# EAGLE design RSS 0.3 (EAGLE 6.5.0)
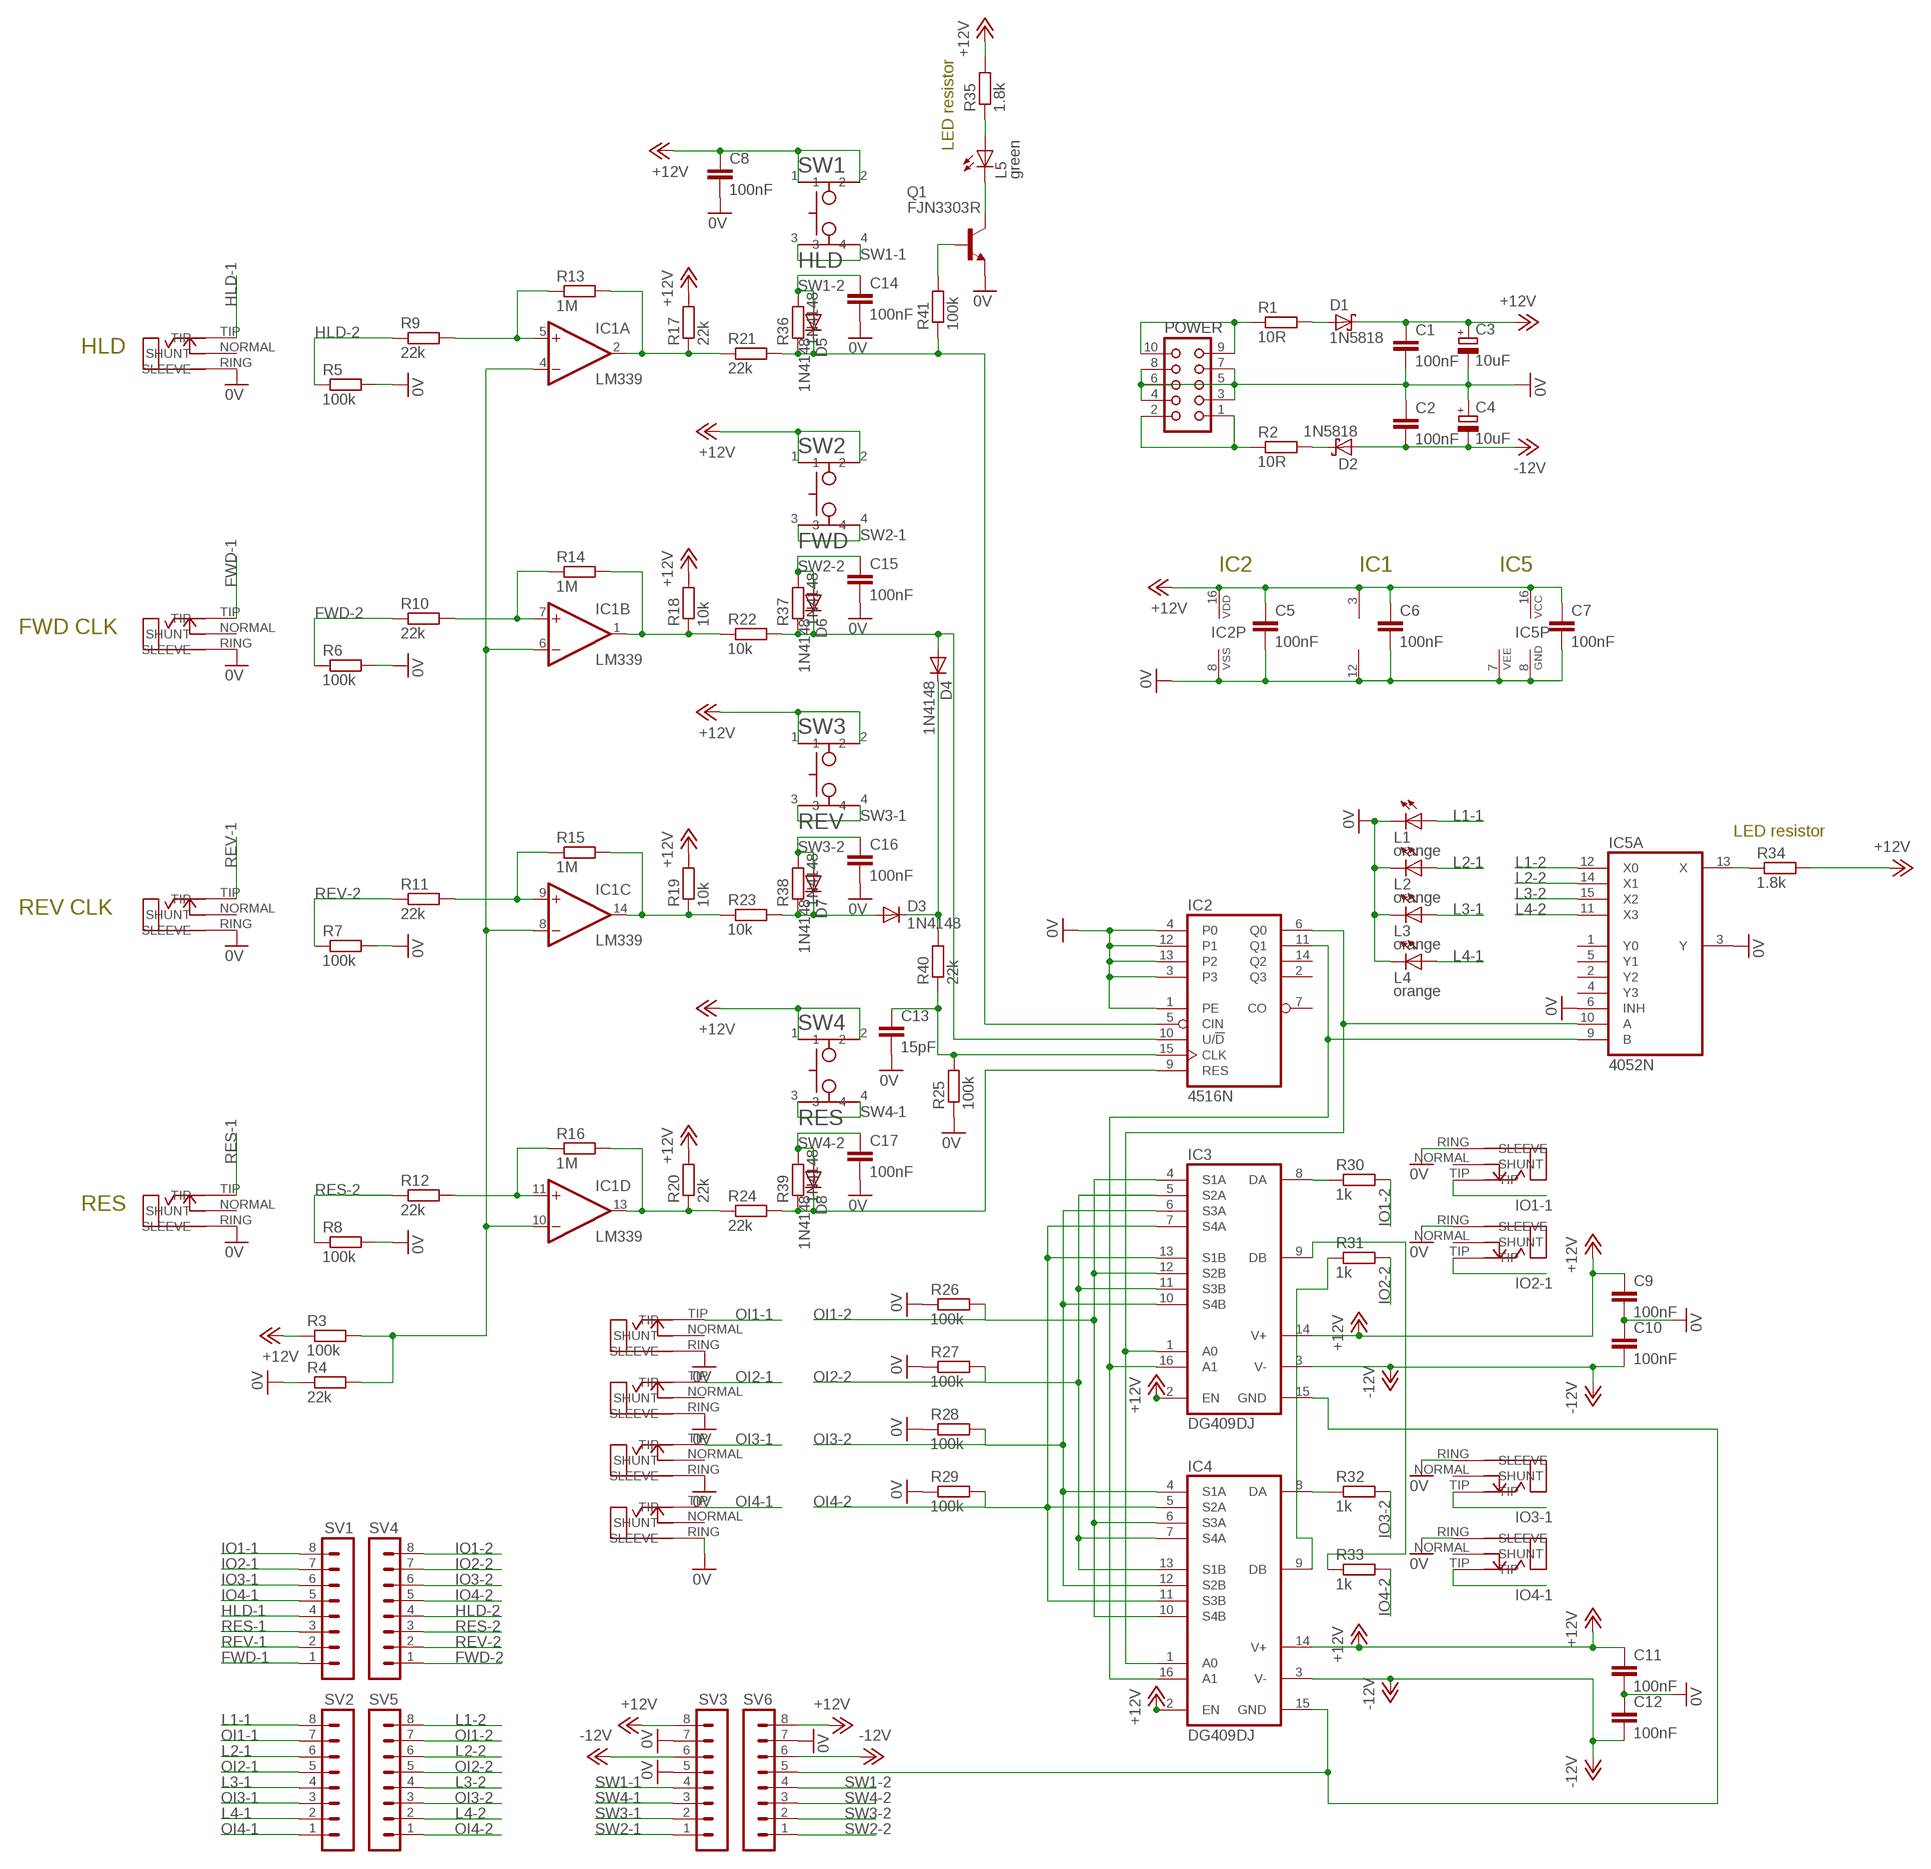
[diagram p0: schematic, sheet 1]

## Parts
C1  100nF  C-EU025-024X044  [C025-024X044]
C2  100nF  C-EU025-024X044  [C025-024X044]
C3  10uF  CPOL-EUE2-5  [E2-5]
C4  10uF  CPOL-EUE2-5  [E2-5]
C5  100nF  C-EU025-024X044  [C025-024X044]
C6  100nF  C-EU025-024X044  [C025-024X044]
C7  100nF  C-EU025-024X044  [C025-024X044]
C8  100nF  C-EU025-024X044  [C025-024X044]
C9  100nF  C-EU025-024X044  [C025-024X044]
C10  100nF  C-EU025-024X044  [C025-024X044]
C11  100nF  C-EU025-024X044  [C025-024X044]
C12  100nF  C-EU025-024X044  [C025-024X044]
C13  15pF  C-EU025-024X044  [C025-024X044]
C14  100nF  C-EU025-024X044  [C025-024X044]
C15  100nF  C-EU025-024X044  [C025-024X044]
C16  100nF  C-EU025-024X044  [C025-024X044]
C17  100nF  C-EU025-024X044  [C025-024X044]
D1  1N5818  SB130DO-204AL  [DO41-7]
D2  1N5818  SB130DO-204AL  [DO41-7]
D3  1N4148  1N4148DO35-7  [DO35-7]
D4  1N4148  1N4148DO35-7  [DO35-7]
D5  1N4148  1N4148DO35-7  [DO35-7]
D6  1N4148  1N4148DO35-7  [DO35-7]
D7  1N4148  1N4148DO35-7  [DO35-7]
D8  1N4148  1N4148DO35-7  [DO35-7]
FWD  ERTHENVAR_3.5MM_JACK  [THONKICON]
HLD  ERTHENVAR_3.5MM_JACK  [THONKICON]
I/O1  ERTHENVAR_3.5MM_JACK  [THONKICON]
I/O2  ERTHENVAR_3.5MM_JACK  [THONKICON]
I/O3  ERTHENVAR_3.5MM_JACK  [THONKICON]
I/O4  ERTHENVAR_3.5MM_JACK  [THONKICON]
IC1  LM339  LM2901N  [DIL14]
IC2  4516N  [DIL16]
IC3  DG409DJ  [DIL16]
IC4  DG409DJ  [DIL16]
IC5  4052N  [DIL16]
L1  orange  LED3MM  [LED3MM]
L2  orange  LED3MM  [LED3MM]
L3  orange  LED3MM  [LED3MM]
L4  orange  LED3MM  [LED3MM]
L5  green  LED3MM  [LED3MM]
O/I1  ERTHENVAR_3.5MM_JACK  [THONKICON]
O/I2  ERTHENVAR_3.5MM_JACK  [THONKICON]
O/I3  ERTHENVAR_3.5MM_JACK  [THONKICON]
O/I4  ERTHENVAR_3.5MM_JACK  [THONKICON]
POWER  CON10L  [CON10L]
Q1  FJN3303R  [TO92-LINE]
R1  10R  R-EU_0207/10  [0207/9]
R2  10R  R-EU_0207/10  [0207/9]
R3  100k  R-EU_0207/10  [0207/9]
R4  22k  R-EU_0207/10  [0207/9]
R5  100k  R-EU_0207/10  [0207/9]
R6  100k  R-EU_0207/10  [0207/9]
R7  100k  R-EU_0207/10  [0207/9]
R8  100k  R-EU_0207/10  [0207/9]
R9  22k  R-EU_0207/10  [0207/9]
R10  22k  R-EU_0207/10  [0207/9]
R11  22k  R-EU_0207/10  [0207/9]
R12  22k  R-EU_0207/10  [0207/9]
R13  1M  R-EU_0207/10  [0207/9]
R14  1M  R-EU_0207/10  [0207/9]
R15  1M  R-EU_0207/10  [0207/9]
R16  1M  R-EU_0207/10  [0207/9]
R17  22k  R-EU_0207/10  [0207/9]
R18  10k  R-EU_0207/10  [0207/9]
R19  10k  R-EU_0207/10  [0207/9]
R20  22k  R-EU_0207/10  [0207/9]
R21  22k  R-EU_0207/10  [0207/9]
R22  10k  R-EU_0207/10  [0207/9]
R23  10k  R-EU_0207/10  [0207/9]
R24  22k  R-EU_0207/10  [0207/9]
R25  100k  R-EU_0207/10  [0207/9]
R26  100k  R-EU_0207/10  [0207/9]
R27  100k  R-EU_0207/10  [0207/9]
R28  100k  R-EU_0207/10  [0207/9]
R29  100k  R-EU_0207/10  [0207/9]
R30  1k  R-EU_0207/10  [0207/9]
R31  1k  R-EU_0207/10  [0207/9]
R32  1k  R-EU_0207/10  [0207/9]
R33  1k  R-EU_0207/10  [0207/9]
R34  1.8k  R-EU_0207/10  [0207/9]
R35  1.8k  R-EU_0207/10  [0207/9]
R36  1N4148  R-EU_0207/10  [0207/9]
R37  1N4148  R-EU_0207/10  [0207/9]
R38  1N4148  R-EU_0207/10  [0207/9]
R39  1N4148  R-EU_0207/10  [0207/9]
R40  22k  R-EU_0207/10  [0207/9]
R41  100k  R-EU_0207/10  [0207/9]
RES  ERTHENVAR_3.5MM_JACK  [THONKICON]
REV  ERTHENVAR_3.5MM_JACK  [THONKICON]
SV1  MA08-1  [MA08-1]
SV2  MA08-1  [MA08-1]
SV3  MA08-1  [MA08-1]
SV4  MA08-1  [MA08-1]
SV5  MA08-1  [MA08-1]
SV6  MA08-1  [MA08-1]
SW1  HLD  TACTILE_ALPS  [TACTILE_ALPS]
SW2  FWD  TACTILE_ALPS  [TACTILE_ALPS]
SW3  REV  TACTILE_ALPS  [TACTILE_ALPS]
SW4  RES  TACTILE_ALPS  [TACTILE_ALPS]

## Nets
0V: C1.2 C2.1 C3.- C4.+ C5.2 C6.2 C7.2 C8.2 C9.2 C10.1 C11.2 C12.1 C13.2 C14.2 C15.2 C16.2 C17.2 FWD.RING(SLEEVE) HLD.RING(SLEEVE) I/O1.RING(SLEEVE) I/O2.RING(SLEEVE) I/O3.RING(SLEEVE) I/O4.RING(SLEEVE) IC1.12(P:V-) IC2.1(PE) IC2.3 IC2.4(P0) IC2.8(VSS) IC2.12(P1) IC2.13(P2) IC5.3(A:Y) IC5.6(A:INH) IC5.7(P:VEE) IC5.8(P:GND) L1.K(C) L2.K(C) L3.K(C) L4.K(C) O/I1.RING(SLEEVE) O/I2.RING(SLEEVE) O/I3.RING(SLEEVE) O/I4.RING(SLEEVE) POWER.3 POWER.4 POWER.5 POWER.6 POWER.7 POWER.8 Q1.3(E) R4.1 R5.2 R6.2 R7.2 R8.2 R25.1 R26.1 R27.1 R28.1 R29.1 RES.RING(SLEEVE) REV.RING(SLEEVE) SV3.5 SV3.7 SV6.7
+12V: C1.1 C3.+ C5.1 C6.1 C7.1 C8.1 C9.1 C11.1 D1.C IC1.3(P:V+) IC2.16(VDD) IC3.2(EN) IC3.14(V+) IC4.2(EN) IC4.14(V+) IC5.16(P:VCC) R3.1 R17.2 R18.2 R19.2 R20.2 R34.2 R35.2 SV3.8 SV6.8 SW1.1 SW1.2 SW2.1 SW2.2 SW3.1 SW3.2 SW4.1 SW4.2
-12V: C2.2 C4.- C10.2 C12.2 D2.A IC3.3(V-) IC4.3(V-) SV3.6 SV6.6
FWD-1: FWD.TIP SV1.1
FWD-2: R6.1 R10.1 SV4.1
HLD-1: HLD.TIP SV1.4
HLD-2: R5.1 R9.1 SV4.4
IO1-1: I/O1.TIP SV1.8
IO1-2: R30.2 SV4.8
IO2-1: I/O2.TIP SV1.7
IO2-2: R31.2 SV4.7
IO3-1: I/O3.TIP SV1.6
IO3-2: R32.2 SV4.6
IO4-1: I/O4.TIP SV1.5
IO4-2: R33.2 SV4.5
L1-1: L1.A SV2.8
L1-2: IC5.12(A:X0) SV5.8
L2-1: L2.A SV2.6
L2-2: IC5.14(A:X1) SV5.6
L3-1: L3.A SV2.4
L3-2: IC5.15(A:X2) SV5.4
L4-1: L4.A SV2.2
L4-2: IC5.11(A:X3) SV5.2
N$1: IC2.11(Q1) IC3.16(A1) IC4.16(A1) IC5.9(A:B)
N$2: IC2.6(Q0) IC3.1(A0) IC4.1(A0) IC5.10(A:A)
N$3: IC3.15(GND) IC4.15(GND) SV6.5
N$4: C13.1 IC2.15(CLK) R25.2 R40.1
N$5: IC3.9(DB) R33.1
N$6: IC4.9(DB) R31.1
N$7: Q1.1(B) R41.2
N$9: IC4.8(DA) R32.1
N$13: IC3.8(DA) R30.1
N$16: IC1.14(C:OUT) R15.2 R19.1 R23.1
N$19: IC5.13(A:X) R34.1
N$20: D5.C IC2.5(CIN) R21.2 R36.1 R41.1
N$21: IC1.7(B:+IN) R10.2 R14.1
N$22: POWER.1 POWER.2 R2.1
N$23: POWER.9 POWER.10 R1.1
N$24: D1.A R1.2
N$25: D2.C R2.2
N$26: IC1.5(A:+IN) R9.2 R13.1
N$27: IC1.9(C:+IN) R11.2 R15.1
N$28: IC1.2(A:OUT) R13.2 R17.1 R21.1
N$29: IC1.4(A:-IN) IC1.6(B:-IN) IC1.8(C:-IN) IC1.10(D:-IN) R3.2 R4.2
N$31: IC1.11(D:+IN) R12.2 R16.1
N$34: D4.A D6.C IC2.10(U/!D) R22.2 R37.1
N$35: D8.C IC2.9(RES) R24.2 R39.1
N$39: D3.C D4.C R40.2
N$40: IC1.13(D:OUT) R16.2 R20.1 R24.1
N$41: L5.A R35.1
N$42: IC1.1(B:OUT) R14.2 R18.1 R22.1
N$43: L5.K(C) Q1.2(C)
N$46: D3.A D7.C R23.2 R38.1
OI1-1: O/I1.TIP SV2.7
OI1-2: IC3.4(S1A) IC3.12(S2B) IC4.6(S3A) IC4.10(S4B) R26.2 SV5.7
OI2-1: O/I2.TIP SV2.5
OI2-2: IC3.5(S2A) IC3.11(S3B) IC4.7(S4A) IC4.13(S1B) R27.2 SV5.5
OI3-1: O/I3.TIP SV2.3
OI3-2: IC3.6(S3A) IC3.10(S4B) IC4.4(S1A) IC4.12(S2B) R28.2 SV5.3
OI4-1: O/I4.TIP SV2.1
OI4-2: IC3.7(S4A) IC3.13(S1B) IC4.5(S2A) IC4.11(S3B) R29.2 SV5.1
RES-1: RES.TIP SV1.3
RES-2: R8.1 R12.1 SV4.3
REV-1: REV.TIP SV1.2
REV-2: R7.1 R11.1 SV4.2
SW1-1: SV3.4 SW1.3 SW1.4
SW1-2: C14.1 D5.A R36.2 SV6.4
SW2-1: SV3.1 SW2.3 SW2.4
SW2-2: C15.1 D6.A R37.2 SV6.1
SW3-1: SV3.2 SW3.3 SW3.4
SW3-2: C16.1 D7.A R38.2 SV6.2
SW4-1: SV3.3 SW4.3 SW4.4
SW4-2: C17.1 D8.A R39.2 SV6.3
Unconnected: FWD.NORMAL(SHUNT) HLD.NORMAL(SHUNT) I/O1.NORMAL(SHUNT) I/O2.NORMAL(SHUNT) I/O3.NORMAL(SHUNT) I/O4.NORMAL(SHUNT) IC2.2(Q3) IC2.7(CO) IC2.14(Q2) IC5.1(A:Y0) IC5.2(A:Y2) IC5.4(A:Y3) IC5.5(A:Y1) O/I1.NORMAL(SHUNT) O/I2.NORMAL(SHUNT) O/I3.NORMAL(SHUNT) O/I4.NORMAL(SHUNT) RES.NORMAL(SHUNT) REV.NORMAL(SHUNT)

## Notes on the sheet
- LED resistor
- HLD
- IC2 | IC1 | IC5
- FWD CLK
- LED resistor
- REV CLK
- RES

## Library data of the parts
C1 C2 C5-C17 = Roll Your Own:C-EU: CAPACITOR, European symbol
C3 C4 = Roll Your Own:CPOL-EU: POLARIZED CAPACITOR, European symbol
D1 D2 = Roll Your Own:SB130
D3-D8 = Roll Your Own:1N4148: DIODE high speed (Philips)
FWD HLD I/O1-I/O4 O/I1-O/I4 RES REV = Roll Your Own:ERTHENVAR_3.5MM_JACK
IC1 = Roll Your Own:LM2901: COMPARATOR
IC2 = Roll Your Own:4516: Binary up down COUNTER
IC3 IC4 = maxim:DG409DJ: ANALOG MULTIPLEXER; MF: INTERSIL; MPN: DG409DJ; OC_FARNELL: 9664084; OC_NEWARK: 06F3963
IC5 = Roll Your Own:4052: Dual 4-channel ANALOG MULTIPLEXER
L1-L5 = Roll Your Own:LED: LED OSRAM: - CHIPLED LG R971, LG N971, LY N971, LG Q971, LY Q971, LO R971, LY R971 LH N974, LH R974 LS Q976, LO Q976, LY Q976 LO Q996 - Hyper CHIPLED LW Q18S LB Q993, LB Q99A, LB R99A - SideLED LS A670, LO A670, LY A670, LG A670, LP A670 LB A673, LV A673, LT A673, LW A673 LH A674 LY A675 LS A676, LA A676, LO A676, LY A676, LW A676 LS A679, LY A679, LG A679 - Hyper Micro SIDELED® LS Y876, LA Y876, LO Y876, LY Y876 LT Y87S - SmartLED LW L88C, LW L88S LB L89C, LB L89S, LG L890 LS L89K, LO L89K, LY L89K LS L896, LA L896, LO L896, LY L896 - TOPLED LS T670, LO T670, LY T670, LG T670, LP T670 LSG T670, LSP T670, LSY T670, LOP T670, LYG T670 LG T671, LOG T671, LSG T671 LB T673, LV T673, LT T673, LW T673 LH T674 LS T676, LA T676, LO T676, LY T676, LB T676, LH T676, LSB T676, LW T676 LB T67C, LV T67C, LT T67C, LS T67K, LO T67K, LY T67K, LW E67C LS E67B, LA E67B, LO E67B, LY E67B, LB E67C, LV E67C, LT E67C LW T67C LS T679, LY T679, LG T679 LS T770, LO T770, LY T770, LG T770, LP T770 LB T773, LV T773, LT T773, LW T773 LH T774 LS E675, LA E675, LY E675, LS T675 LS T776, LA T776, LO T776, LY T776, LB T776 LHGB T686 LT T68C, LB T68C - Hyper Mini TOPLED® LB M676 - Mini TOPLED Santana® LG M470 LS M47K, LO M47K, LY M47K Source: http://www.osram.convergy.de LUXEON: - LUMILED® LXK2-PW12-R00, LXK2-PW12-S00, LXK2-PW14-U00, LXK2-PW14-V00 LXK2-PM12-R00, LXK2-PM12-S00, LXK2-PM14-U00 LXK2-PE12-Q00, LXK2-PE12-R00, LXK2-PE12-S00, LXK2-PE14-T00, LXK2-PE14-U00 LXK2-PB12-K00, LXK2-PB12-L00, LXK2-PB12-M00, LXK2-PB14-N00, LXK2-PB14-P00, LXK2-PB14-Q00 LXK2-PR12-L00, LXK2-PR12-M00, LXK2-PR14-Q00, LXK2-PR14-R00 LXK2-PD12-Q00, LXK2-PD12-R00, LXK2-PD12-S00 LXK2-PH12-R00, LXK2-PH12-S00 LXK2-PL12-P00, LXK2-PL12-Q00, LXK2-PL12-R00 Source: www.luxeon.com KINGBRIGHT: KA-3528ASYC Source: www.kingbright.com
POWER = Roll Your Own:CON10L: CONNECTOR; OC_FARNELL: unknown; OC_NEWARK: unknown
Q1 = Roll Your Own:FJN3303R
R1-R41 = Roll Your Own:R-EU_: RESISTOR, European symbol
SV1-SV6 = Roll Your Own:MA08-1: PIN HEADER; OC_FARNELL: unknown; OC_NEWARK: unknown
SW1-SW4 = Roll Your Own:TACTILE_ALPS

## Board
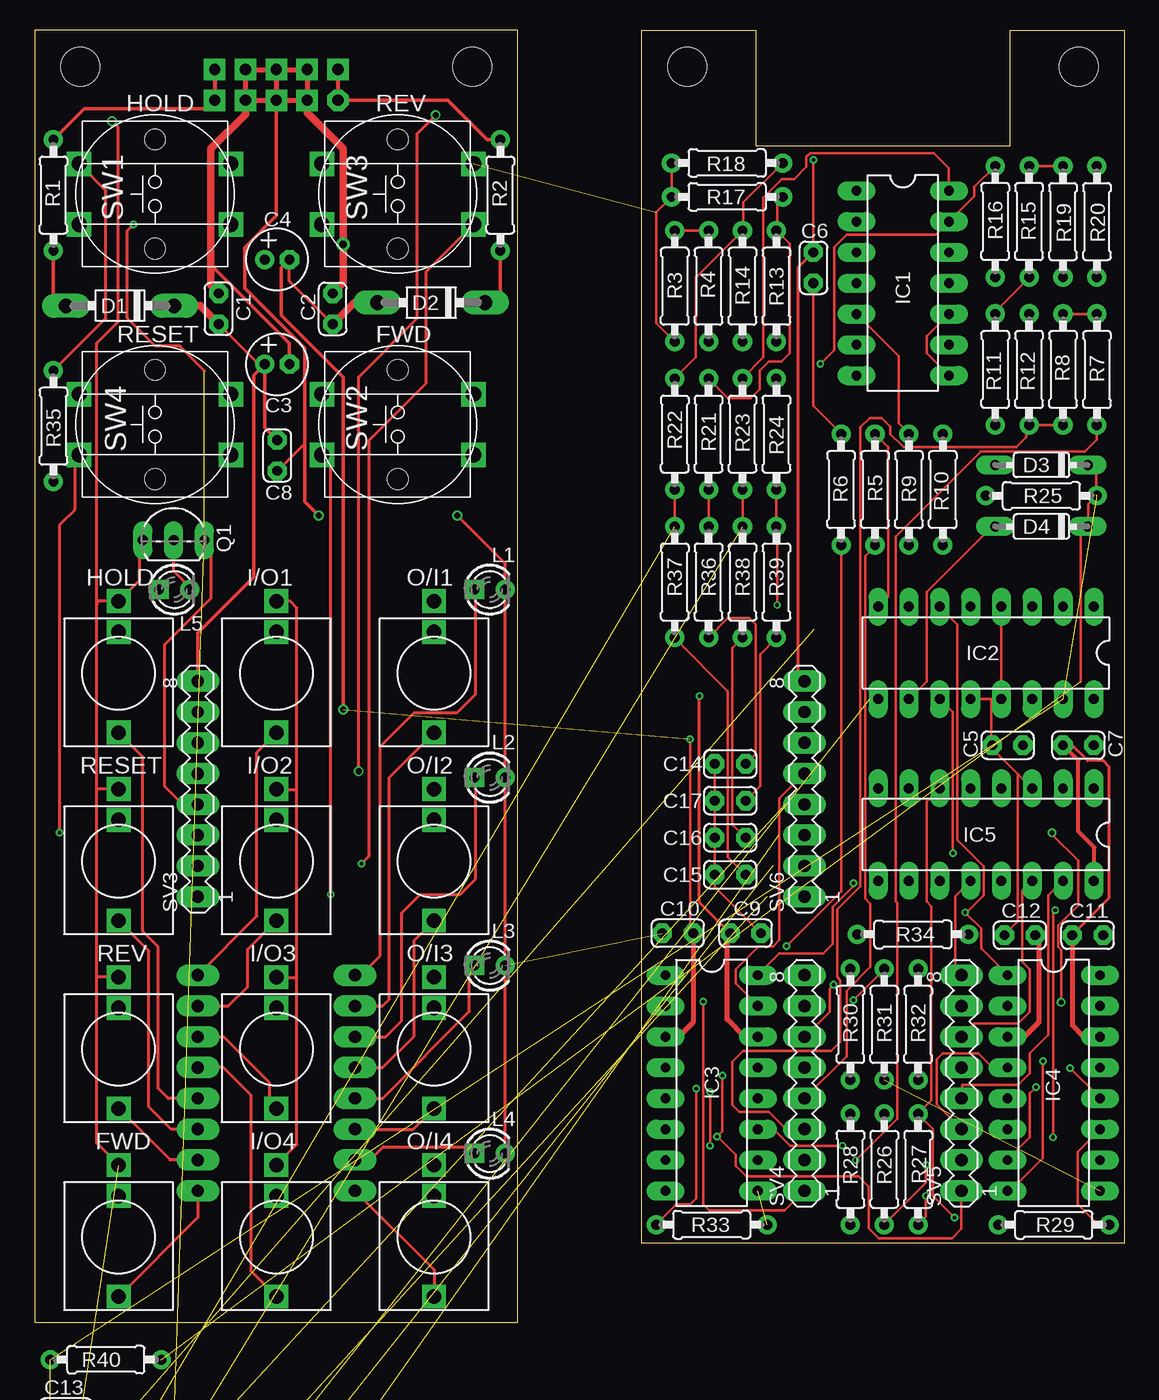
[diagram p1: board, top side]
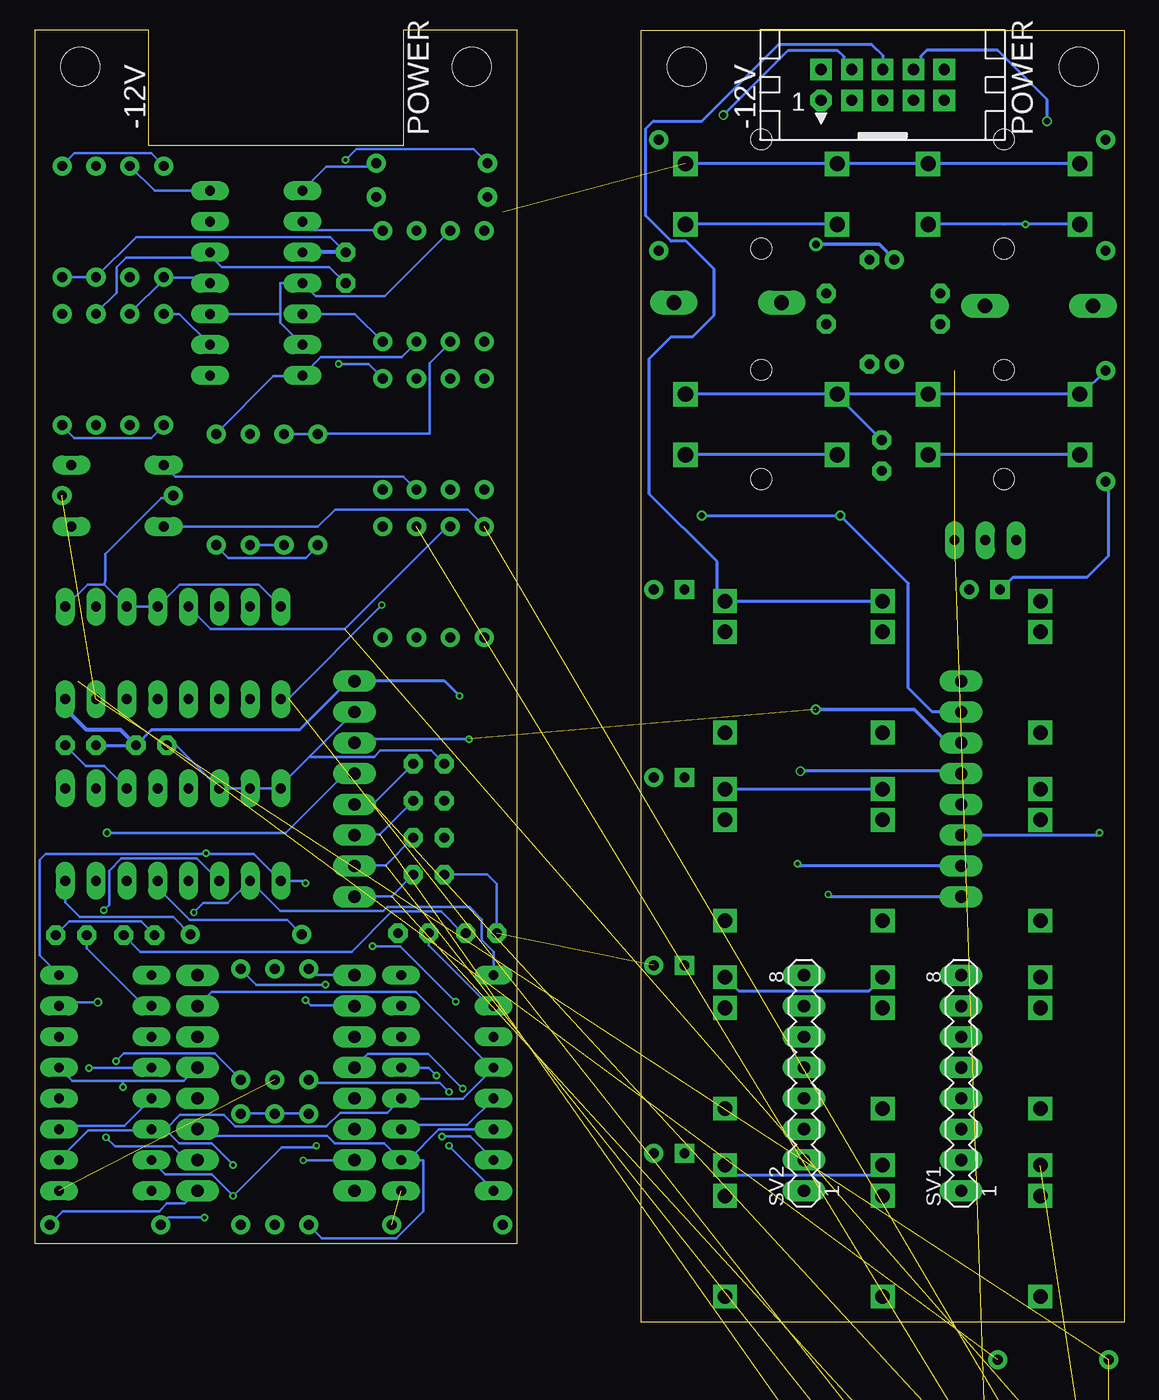
[diagram p2: board, bottom side, seen from below]

Size 89.8 x 106.5 mm. Coordinates in mm from the lower left corner, seen from the top.
Outline: 0,0 39.8,0 39.8,106.5 0,106.5 0,0
Outline: 50,106.5 59.4,106.5 59.4,97 80.4,97 80.4,106.5 89.8,106.5 89.8,6.5 50,6.5 50,106.5
Copper layers (1*16): Top 0.035mm / dielectric 1.5mm / Bottom 0.035mm
Design rules "hackvana 15 mil pads 24 mil thermal *": minimum track width 0.22mm, minimum drill 0.3mm, track to track 6mil, track to pad 6mil, pad to pad 6mil, via to via 6mil, smd to smd 0mil, copper to edge 6mil, drill to drill 6mil, minimum pad ring 15mil, minimum via ring 6mil, stop-mask expansion 2mil, vias tented up to drill 100mil, thermal gap 24mil
Holes 3.2 mm at 3.75,103.5 36.05,103.5 53.75,103.5 86.05,103.5

### Footprints (pad centres in the part's own frame; a part is rotated, then mirrored left to right if it is on the bottom)
C025-024X044 = drill 0.813 octagon: 1 -1.27,0; 2 1.27,0
E2-5 = drill 0.813 pad 1.27: + -1.016,0 | drill 0.813 pad 1.27 octagon: - 1.016,0
DO41-7 = drill 1.2 pad 1.6 long: A 4.445,0; C -4.445,0
DO35-7 = drill 0.813 pad 1.27 long: A 3.81,0; C -3.81,0
THONKICON = drill 1.2 square: NORMAL 0,-3.4; RING 0,-5.94; TIP 0,4.9
DIL14 = drill 0.813 long: 1 -7.62,-3.81; 2 -5.08,-3.81; 3 -2.54,-3.81; 4 0,-3.81; 5 2.54,-3.81; 6 5.08,-3.81; 7 7.62,-3.81; 8 7.62,3.81; 9 5.08,3.81; 10 2.54,3.81; 11 0,3.81; 12 -2.54,3.81; 13 -5.08,3.81; 14 -7.62,3.81
DIL16 = drill 0.813 long: 1 -8.89,-3.81; 2 -6.35,-3.81; 3 -3.81,-3.81; 4 -1.27,-3.81; 5 1.27,-3.81; 6 3.81,-3.81; 7 6.35,-3.81; 8 8.89,-3.81; 9 8.89,3.81; 10 6.35,3.81; 11 3.81,3.81; 12 1.27,3.81; 13 -1.27,3.81; 14 -3.81,3.81; 15 -6.35,3.81; 16 -8.89,3.81
LED3MM = drill 0.813 square: A -1.27,0 | drill 0.813: K 1.27,0
CON10L = drill 0.914 pad 1.778 octagon: 1 5.08,1.27 | drill 0.914 pad 1.778 square: 2 5.08,-1.27; 3 2.54,1.27; 4 2.54,-1.27; 5 0,1.27; 6 0,-1.27; 7 -2.54,1.27; 8 -2.54,-1.27; 9 -5.08,1.27; 10 -5.08,-1.27
TO92-LINE = drill 0.813 long: 1 2.54,0; 2 0,0; 3 -2.54,0
0207/9 = drill 0.813: 1 -4.58,0; 2 4.58,0
MA08-1 = drill 1.016 long: 1 -8.89,0; 2 -6.35,0; 3 -3.81,0; 4 -1.27,0; 5 1.27,0; 6 3.81,0; 7 6.35,0; 8 8.89,0
TACTILE_ALPS = drill 1.25 square: 1 -6.25,2.5; 2 6.25,2.5; 3 -6.25,-2.5; 4 6.25,-2.5 | hole 1.7: 0,4.5; 0,-4.5

### Placement (x,y rotation side)
C1  15.14,83.54 90 top
C2  24.54,83.54 270 top
C3  19.97,78.97 0 top
C4  19.97,87.61 0 top
C5  80.16,47.55 180 top
C6  64.16,86.92 270 top
C7  86.01,47.55 0 top
C8  19.97,71.45 270 top
C9  58.57,32.06 0 top
C10  52.99,32.06 0 top
C11  86.77,31.9 0 top
C12  81.18,31.9 0 top
C13  2.54,-7.42 0 top  (outside the outline)
C14  57.3,46.03 180 top
C15  57.3,36.89 180 top
C16  57.3,39.93 180 top
C17  57.3,42.98 180 top
D1  7.01,83.8 180 top
D2  32.67,84.05 180 top
D3  82.96,70.67 180 top
D4  82.96,65.59 180 top
D5  6.1,-13.77 0 top  (outside the outline)
D6  6.1,-20.12 0 top  (outside the outline)
D7  6.1,-26.47 0 top  (outside the outline)
D8  6.1,-32.82 0 top  (outside the outline)
FWD  6.9,7 180 top
HLD  6.9,53.5 180 top
I/O1  19.9,53.5 180 top
I/O2  19.9,38 180 top
I/O3  19.9,22.5 180 top
I/O4  19.9,7 180 top
IC1  71.53,85.65 270 top
IC2  78.39,55.17 180 top
IC3  55.78,19.71 270 top
IC4  83.97,19.71 270 top
IC5  78.39,40.19 180 top
L1  37.5,60.4 0 top
L2  37.5,44.9 0 top
L3  37.5,29.4 0 top
L4  37.5,13.9 0 top
L5  11.5,60.4 0 top
O/I1  32.9,53.5 180 top
O/I2  32.9,38 180 top
O/I3  32.9,22.5 180 top
O/I4  32.9,7 180 top
POWER  19.9,102 180 bottom
Q1  11.43,64.47 0 top
R1  1.53,92.91 270 top
R2  38.36,92.91 270 top
R3  52.73,85.4 90 top
R4  55.53,85.4 90 top
R5  69.24,68.64 90 top
R6  66.45,68.64 90 top
R7  87.53,78.54 90 top
R8  84.74,78.54 90 top
R9  72.04,68.64 90 top
R10  74.83,68.64 90 top
R11  79.15,78.54 90 top
R12  81.94,78.54 90 top
R13  61.11,85.4 90 top
R14  58.32,85.4 90 top
R15  81.94,90.73 90 top
R16  79.15,90.73 90 top
R17  57.05,92.77 180 top
R18  57.05,95.56 180 top
R19  84.74,90.73 270 top
R20  87.53,90.73 270 top
R21  55.53,73.21 270 top
R22  52.73,73.21 270 top
R23  58.32,73.21 270 top
R24  61.11,73.21 270 top
R25  82.96,68.13 0 top
R26  70,12.6 270 top
R27  72.8,12.6 270 top
R28  67.21,12.6 270 top
R29  83.97,8.02 0 top
R30  67.21,24.53 90 top
R31  70,24.53 90 top
R32  72.8,24.53 90 top
R33  55.78,8.02 180 top
R34  72.37,31.96 0 top
R35  1.53,73.86 90 top
R36  55.53,61.02 270 top
R37  52.73,61.02 270 top
R38  58.32,61.02 270 top
R39  61.11,61.02 270 top
R40  5.85,-3.1 0 top  (outside the outline)
R41  5.85,-39.17 0 top  (outside the outline)
RES  6.9,38 180 top
REV  6.9,22.5 180 top
SV1  13.43,19.71 90 bottom
SV2  26.38,19.71 90 bottom
SV3  13.43,43.95 90 top
SV4  63.43,19.71 90 top
SV5  76.38,19.71 90 top
SV6  63.43,43.95 90 top
SW1  9.9,93 0 top
SW2  29.9,74 0 top
SW3  29.9,93 0 top
SW4  9.9,74 0 top

### Tracks (layer width: path | path; a pad name or v marks a point on that pad's centre or on a via)
0V  (via drill 0.3, 0.5, 0.6 pad 1.1)  (2 unrouted)
  Top 0.22: R8.2 R7.2 | C6.2 64.16,75.56 66.45,73.27 R6.2 | C9.2 56.03,35.87 C15.2 C16.2 C17.2 C14.2 | v75.78,8.63 74,10.41 74,15.93 72.8,17.14 R27.1 72.86,17.27 73.88,18.28 73.88,34.28 73.5,34.66 73.5,42.92 IC5.6 | 78.83,51.36 IC2.13 IC2.4 | 78.83,51.36 IC2.12 | 81.05,45.14 78.89,47.3 C5.2 78.83,47.62 78.83,51.36 | 81.05,45.14 IC5.3 | C12.1 79.91,31.93 80.99,33.01 80.99,45.08 81.05,45.14 | IC2.8 70.32,59.81 70.32,72.13 69.24,73.21 R5.2
  Top 0.254: 19.97,100.66 POWER.5 | v26.67,45.42 26.67,77.93 31.5,82.75 31.5,97.99 v33.02,99.52 | FWD.RING 5.08,14.76 5.08,28.4 | 5.08,28.4 5.08,43.89 | 5.08,43.89 5.08,59.13 | 5.08,59.13 5.08,80.72 6.86,82.5 6.86,98.5 v6.35,99.01 | REV.RING 5.13,28.44 5.08,28.4 | RES.RING 5.13,43.94 5.08,43.89 | 5.08,59.13 5.14,59.44 HLD.RING 8.64,61.18 8.64,63.7 8.89,63.96 Q1.3 | I/O4.RING 21.59,14.63 21.59,28.4 | 21.59,28.4 21.59,43.89 | 21.59,43.89 21.59,58.88 21.03,59.44 I/O1.RING | I/O2.RING 19.95,43.89 21.59,43.89 | I/O3.RING 19.94,28.4 21.59,28.4 | L4.K L3.K L2.K L1.K 38.77,62.53 v34.8,66.5 | 22.23,72.44 C8.2
  Top 0.305: C3.- 20.98,80.7 14.48,87.2 | POWER.5 19.9,91.22 17.28,88.6 17.28,85.23 22.23,80.28 22.23,72.44 22.23,67.66 v23.39,66.5
  Top 0.35: 19.88,100.73 19.97,100.64 | 17.26,100.73 POWER.7
  Top 0.406: POWER.6 POWER.4 POWER.3 POWER.5 POWER.6 | POWER.6 POWER.8 POWER.7 19.88,100.73
  Top 0.61: C2.1 25.4,85.68 v25.4,88.85 25.4,96.72 22.44,99.69 POWER.3 | C1.2 14.48,85.47 14.48,87.2 14.48,96.72 17.36,99.6 POWER.7
  Bottom 0.22: R4.1 55.53,80.76 57.24,79.05 57.24,73.27 66.45,73.27 R6.2 66.51,73.21 69.24,73.21 R5.2 | C6.2 65.5,86.99 74.39,86.99 75.21,87.81 | IC1.12 75.21,87.81 | R8.2 84.74,83.18 83.02,84.89 83.02,86.99 82.26,87.75 75.78,87.75 75.21,87.81 | IC2.8 71.34,60.83 77.81,60.83 IC2.4 IC2.3 84.04,60.83 | IC2.1 85.43,60.83 84.04,60.83 | R25.1 78.83,67.94 79.34,67.94 83.97,63.3 83.97,61.14 84.04,60.83 | C10.1 51.72,36.12 52.48,36.89 C15.2 | R28.1 67.21,17.2 70,17.2 R26.1 70.07,17.2 72.8,17.2 R27.1 | v75.78,8.63 78.77,8.63 79.34,8.06 R29.1 | 67.08,46.66 69.69,44.06 IC5.8 IC5.7 IC5.6 78.13,47.55 C5.2 | 67.08,46.66 63.46,50.28 SV6.7 | C12.1 79.91,31.93 80.99,33.01 86.96,33.01 88.04,31.93 C11.2 | C7.2 85.56,45.84 84.04,45.84 IC5.3 | C14.2 57.11,47.11 61.3,47.11 61.81,46.6 67.02,46.6 67.08,46.66
  Bottom 0.254: SV3.5 14.54,45.22 14.74,45.42 v26.67,45.42 | v33.02,99.52 27.69,104.85 23.63,104.85 23.12,104.34 23.12,103.95 POWER.4 | v6.35,99.01 6.35,100.79 10.42,104.85 16.26,104.85 16.77,104.34 16.77,103.86 POWER.8 | I/O4.RING 20.76,12.08 32.04,12.08 O/I4.RING | O/I3.RING 31.78,27.32 21.02,27.32 I/O3.RING | O/I2.RING I/O2.RING | I/O1.RING O/I1.RING 33.53,60.07 33.53,62.69 39.12,68.28 39.12,79.45 37.34,81.23 35.56,81.23 33.79,83.01 33.79,86.82 36.07,89.1 37.34,89.1 39.44,91.2 39.44,98.38 38.8,99.01 34.8,99.01 28.45,105.36 20.83,105.36 19.9,104.43 POWER.6 | v34.8,66.5 v23.39,66.5 17.78,60.89 17.78,52.27 15.81,50.3 SV3.7
  Bottom 0.305: C4.+ 20.19,88.85 v25.4,88.85
+12V  (via drill 0.3)  (1 unrouted)
  Top 0.22: C6.1 v64.16,95.81 | R18.2 R17.2 52.47,92.76 51.21,91.5 51.21,82.34 R3.1
  Top 0.254: C11.1 88.55,34.95 88.55,45.78 88.04,46.28 86.77,46.28 85.5,47.55 C7.1 | C9.1 54.76,34.6 v54.76,51.62 | C6.1 62.89,86.92 62.89,53.4 63.42,52.86 SV6.8 | C1.1 18.44,78.97 C3.+ | R35.2 5.85,82.76 5.85,93.3 3.77,95.37 SW1.1
  Top 0.305: SV3.8 13.43,56.81 18.04,61.42 18.04,78.06 C3.+ 18.95,73.73 C8.1
  Top 0.35: 86.42,23.52 IC4.14 | 58.48,23.52 IC3.14 | C7.1 86.01,46.28 86.01,40.44 86.11,40.34 87.32,39.13 87.32,36.42 IC5.16
  Top 0.406: C11.1 85.5,24.44 86.42,23.52 | 58.48,23.52 57.05,24.95 57.05,31.81 C9.1
  Top 0.61: D1.C 13.62,83.8 C1.1
  Bottom 0.22: R34.2 78.38,33.39 86.07,33.39 87.28,34.6 IC5.16 | v64.16,95.81 63.27,96.7 53.61,96.7 R18.2 | IC3.2 52.32,26.06 57.3,31.04 C9.1 | IC4.2 80.77,26.06 85.5,30.79 C11.1 | R20.2 R19.2 81.43,89.46 65.43,89.46 C6.1
  Bottom 0.254: C7.1 C5.1 80.16,48.82 67.97,48.82 64.16,52.63 63.63,52.63 SV6.8 55.99,52.84 v54.76,51.62 | C8.1 23.65,76.4 SW2.1 | SW2.1 SW2.2 | SW2.1 SW4.2 SW4.1 3.47,76.5 R35.2 | SW1.1 SW1.2 SW3.1 SW3.2
  Bottom 0.35: C5.1 82.7,48.82 85.5,48.82 87.28,50.6 IC2.16 | C6.1 IC1.3
-12V  (via drill 0.3, 0.5)  (1 unrouted)
  Top 0.22: C10.2 54,32.31 v54,48.06
  Top 0.254: C2.2 20.98,85.83 C4.-
  Top 0.305: C4.- 20.32,86.95 20.32,83.01 25.4,77.93 v25.4,50.5
  Top 0.35: 53.08,23.52 IC3.3 | 81.53,23.52 IC4.3
  Top 0.406: C10.2 54.26,24.69 53.08,23.52 | C12.2 82.45,31.49 82.77,31.17 82.77,24.76 81.53,23.52
  Top 0.61: D2.A 26.32,84.05 C2.2
  Bottom 0.22: v54,48.06 62.13,48.06 62.64,47.81 63.38,47.81 SV6.6 | C12.2 81.09,30.54 63.65,30.54 60.35,33.84 56.29,33.84 54.51,32.06 C10.2
  Bottom 0.305: v25.4,50.5 17.28,50.5 14.48,47.7 13.48,47.7 SV3.6
FWD-1
  Top 0.254: SV1.1 13.43,8.62 FWD.TIP
FWD-2  (via drill 0.3)
  Top 0.22: v55.08,26.41 55.08,9.71 55.59,9.2 61.81,9.2 63.4,10.79 SV4.1 | v61.94,30.98 66.45,35.49 R6.1
  Bottom 0.22: R6.1 66.45,64 67.46,62.98 73.81,62.98 74.83,64 R10.1 | v55.08,26.41 59.65,30.98 v61.94,30.98
HLD-1
  Top 0.254: SV1.4 10.98,18.44 10.16,19.25 10.16,30.94 8.89,32.21 8.89,46.61 HLD.TIP
HLD-2
  Top 0.22: SV4.4 63.46,18.47 66.89,21.9 66.89,27.3 68.86,29.27 68.86,34.47 68.42,34.92 68.42,63.17 69.24,64 R5.1
  Bottom 0.22: R5.1 R9.1
IO1-1
  Top 0.254: SV1.8 18.29,33.47 18.29,46.94 19.9,48.55 I/O1.TIP
IO1-2
  Bottom 0.22: R30.2 67.21,29.08 66.77,28.63 63.46,28.63 SV4.8
IO2-1
  Top 0.254: SV1.7 15.95,26.06 17.53,27.64 17.53,30.73 I/O2.TIP
IO2-2  (via drill 0.3)
  Top 0.22: v67.46,26.53 70,29.08 R31.2
  Bottom 0.22: v67.46,26.53 67.02,26.09 63.46,26.09 SV4.7
IO3-1
  Top 0.254: SV1.6 15.55,23.52 19.31,19.76 19.31,18.19 I/O3.TIP
IO3-2  (via drill 0.3)
  Top 0.22: v65.81,27.81 65.5,27.49 65.5,25.58 63.46,23.55 SV4.6
  Bottom 0.22: v65.81,27.81 71.53,27.81 72.8,29.08 R32.2
IO4-1
  Top 0.254: SV1.5 13.48,21.03 15.5,21.03 17.78,18.75 17.78,4.22 I/O4.TIP
IO4-2  (via drill 0.3)
  Top 0.22: v54.51,19.23 54.51,10.22 54,9.71 52.86,9.71 51.21,8.06 R33.2
  Bottom 0.22: v54.51,19.23 57.37,22.09 62.32,22.09 63.4,21.01 SV4.5
L1-1
  Top 0.254: SV2.8 26.87,28.6 28.45,30.18 28.45,47.45 31.25,50.24 34.8,50.24 36.33,51.77 36.33,60.3 L1.A
L1-2
  Top 0.22: IC5.12 75.85,35.11 75.85,29.14 76.35,28.63 SV5.8
L2-1
  Top 0.254: SV2.6 28.91,23.52 30.23,24.84 30.23,33.73 31.75,35.26 35.06,35.26 36.33,36.53 36.33,44.8 L2.A
L2-2
  Top 0.22: IC5.14 81.37,35.55 81.37,29.71 82,29.08 82,25.58 81.05,24.63 77.43,24.63 76.42,23.55 SV5.6
L3-1
  Top 0.254: SV2.4 28.65,18.44 35.82,25.6 35.82,28.99 L3.A
L3-2
  Top 0.22: IC5.15 83.53,35.17 83.53,23.68 82,22.15 82,20.5 81.05,19.55 76.42,19.55 76.42,18.47 SV5.4
L4-1
  Top 0.254: SV2.2 26.43,13.41 27.69,13.41 28.71,14.43 35.56,14.43 36.09,13.9 L4.A
L4-2  (via drill 0.3)
  Top 0.22: v84.1,33.97 83.91,33.77 v83.91,15.23
  Bottom 0.22: IC5.11 76.42,38.22 82.64,38.22 83.66,37.2 83.66,34.41 v84.1,33.97 | v83.91,15.23 83.15,14.47 78.45,14.47 77.37,13.39 76.42,13.39 SV5.2
N$1  (via drill 0.3)
  Top 0.22: v67.46,36.19 67.46,35.93 65.75,34.22 65.75,31.17 64.99,30.41 61.37,30.41 59.59,28.63 IC3.16 | IC2.11 75.66,50.28 v75.66,38.66
  Bottom 0.22: v67.46,36.19 67.65,36.38 IC5.9 71.72,38.6 75.66,38.6 | 75.66,38.6 88.86,38.6 89.37,38.09 89.37,30.22 87.78,28.63 IC4.16 | v75.66,38.66 75.66,38.6
N$2  (via drill 0.3)
  Top 0.22: v76.67,33.77 76.73,33.71 | 76.73,33.71 78,32.44 78,30.79 80.16,28.63 IC4.1 | IC2.6 76.04,57.52 76.04,39.74 78.19,37.58 78.19,35.17 76.73,33.71
  Bottom 0.22: IC3.1 51.97,30.54 52.92,31.49 52.92,33.2 53.94,34.22 60.73,34.22 61.05,33.9 69.56,33.9 IC5.10 73.88,34.54 75.91,34.54 v76.67,33.77
N$3  (via drill 0.4)
  Top 0.22: IC3.15 59.59,26.09 57.75,27.93 57.75,29.08 59.65,30.98 60.86,30.98 61.37,31.49 61.37,43.17 63.4,45.2 SV6.5 | v84.59,26.37 84.59,30.68 84.33,30.94 84.33,32.72 85.98,34.37 85.98,38.05 83.82,40.21 v83.82,40.34
  Bottom 0.22: IC4.15 87.48,26.37 v84.59,26.37 | v83.82,40.34 69.09,40.34 64.27,45.16 63.48,45.16 SV6.5
N$4  (3 unrouted)
N$5  (1 unrouted)
N$6  (1 unrouted)
N$7  (1 unrouted)
N$9  (via drill 0.3)
  Top 0.22: v83.08,21.52 83.08,13.52 80.42,10.85 IC4.8
  Bottom 0.22: v83.08,21.52 82.45,22.15 74.96,22.15 72.8,19.99 R32.1
N$13  (via drill 0.3)
  Top 0.22: v55.65,18.98 v55.65,14.53
  Bottom 0.22: v55.65,14.53 51.97,10.85 IC3.8 | v55.65,18.98 56.41,19.74 67.02,19.74 67.21,19.93 R30.1
N$16
  Top 0.22: R15.2 R19.1 | IC1.14 75.34,95.11 74.07,96.39 63.91,96.39 63.59,96.07 63.59,95.24 62.58,94.23 61.56,94.23 60.03,92.7 60.03,79.56 58.32,77.84 R23.1
  Bottom 0.22: IC1.14 79.91,93.27 R15.2
N$19
  Bottom 0.22: IC5.13 79.66,35.81 76.99,33.14 68.99,33.14 67.84,32 R34.1
N$20  (2 unrouted)
  Top 0.22: R21.2 R36.1
  Bottom 0.22: IC2.5 75.28,57.14 64.22,57.14 55.77,65.6 R36.1 | 55.53,65.65 R36.1 | 55.53,65.59 R36.1
N$21
  Bottom 0.22: R14.1 58.32,80.76 59.53,79.56 66.19,79.56 IC1.7 67.78,77.97 70.13,77.97 74.83,73.27 R10.2
N$22
  Top 0.254: 34.04,100.72 34.04,100.73
  Top 0.305: POWER.1 34.04,100.73 | 34.04,100.72 37.27,97.49 R2.1
  Top 0.35: POWER.2 POWER.1
N$23
  Top 0.305: R1.1 4.06,100.03 14.23,100.03 14.82,100.62 POWER.9
  Top 0.35: POWER.10 POWER.9
N$24
  Top 0.305: R1.2 1.53,84.02 1.78,83.77 2.54,83.77 D1.A
N$25
  Top 0.305: R2.2 38.36,84.53 37.85,84.02 37.14,84.02 D2.C
N$26
  Top 0.22: IC1.5 71.21,79.62 71.21,74.1 72.04,73.27 R9.2
  Bottom 0.22: IC1.5 63.4,83.11 R13.1
N$27
  Top 0.22: R11.2 79.15,83.31 81.94,86.1 R15.1
  Bottom 0.22: IC1.9 77.88,83.11 R11.2
N$28
  Top 0.22: R21.1 57.11,76.19 59.02,76.19 59.76,76.93 59.76,78.46 60.5,79.2 61.52,79.2 62.19,79.88 62.19,88.89 R13.2 61.18,90.03 61.18,92.32 R17.1
  Bottom 0.22: IC1.2 67.02,90.03 61.11,90.03 R13.2
N$29
  Top 0.22: IC1.8 73.5,79.88 73.5,81.27 IC1.10 | R3.2 R4.2
  Bottom 0.22: IC1.6 69.56,82.42 69.56,83.11 | 69.56,83.11 69.56,85.65 IC1.4 66.64,84.58 60.92,84.58 R4.2 | 69.56,83.11 IC1.10
N$31
  Bottom 0.22: IC1.11 75.78,86.1 79.15,86.1 R16.1 79.08,86.03 81.94,83.18 R12.2
N$34  (1 unrouted)
  Top 0.22: R22.2 R37.1 | IC2.10 73.5,52.83 73.5,60.19 78.89,65.59 D4.A
  Bottom 0.22: D4.A 66.45,65.59 65.03,67.01 54.11,67.01 52.73,65.63 R37.1 52.73,65.59
N$35  (via drill 0.3)  (1 unrouted)
  Top 0.22: R24.2 R39.1 61.18,65.53 v61.18,59.11
  Bottom 0.22: IC2.9 69.43,51.43 68.86,51.43 v61.18,59.11
N$39  (2 unrouted)
  Top 0.22: 86.2,52.83 86.2,65.02 D4.C 86.83,65.65 86.83,67.43 87.53,68.13 | D3.C 87.47,69.97 87.47,68.19
N$40  (via drill 0.3)
  Top 0.22: v64.73,78.99 65.88,80.13 65.88,88.64 66.89,89.65 74.26,89.65 IC1.13 77.43,92.83 77.43,93.59 R16.2
  Bottom 0.22: v64.73,78.99 62.26,78.99 61.11,77.84 R24.1 | R20.1 87.53,95.37 86.51,96.39 80.16,96.39 79.15,95.37 R16.2
N$41
  Bottom 0.254: L5.A 10.17,60.4 9.15,61.42 3.05,61.42 1.27,63.2 1.27,69.03 R35.1
N$42
  Top 0.22: R22.1 52.73,77.84 54.45,79.56 54.45,86.1 R14.2 58.38,90.03 58.38,92.32 R18.1
  Bottom 0.22: IC1.1 65.75,95.24 62,95.24 61.69,95.56 R18.1
N$43
  Top 0.254: L5.K 12.7,60.47 12.7,60.66 11.43,61.93 Q1.2
N$46  (1 unrouted)
  Top 0.22: R23.2 R38.1
  Bottom 0.22: D3.A 78.19,69.72 59.4,69.72 R23.2
OI1-1
  Top 0.254: SV2.7 28.65,26.06 29.21,26.62 29.21,44.91 O/I1.TIP
OI1-2  (via drill 0.3)
  Top 0.22: v73.43,12.95 73.43,11.49 70,8.06 R26.2
  Bottom 0.22: v73.43,12.95 75.21,14.72 77.88,14.72 79.02,15.87 80.16,15.87 IC4.6 | IC4.10 87.78,13.39 85.37,15.8 80.23,15.8 IC4.6 | SV5.7 76.35,26.09 75.21,27.23 58.38,27.23 52.1,20.95 IC3.4 51.97,20.95 54.51,18.41 59.59,18.41 IC3.12 59.65,18.34 60.73,17.27 64.61,17.27 65.75,16.12 73.24,16.12 74.19,17.07 77.81,17.07 78.96,15.93 IC4.6
OI2-1
  Top 0.254: SV2.5 28.65,20.98 31.25,23.57 31.25,31.45 O/I2.TIP
OI2-2  (via drill 0.3)
  Top 0.22: v73.43,10.41 73.43,8.69 72.8,8.06 R27.2 | v66.58,14.53 62.26,14.53 60.86,15.93 60.61,15.87 59.59,15.87 IC3.11 | v82.51,19.36 82,18.85 82,15.23 80.16,13.39 IC4.7
  Bottom 0.22: 82.51,19.87 77.5,19.87 76.42,20.95 SV5.5 | 82.51,19.87 86.7,19.87 87.78,20.95 IC4.13 | IC3.5 51.97,18.41 54.13,16.25 59.27,16.25 59.59,15.93 IC3.11 | IC4.7 80.16,13.33 79.02,12.18 75.21,12.18 v73.43,10.41 69.43,14.41 66.7,14.41 v66.58,14.53 | v82.51,19.36 82.51,19.87
OI3-1
  Top 0.254: SV2.3 31.2,15.9 O/I3.TIP
OI3-2  (via drill 0.3)
  Top 0.22: IC4.4 80.16,21.01 78.89,21.01 77.75,22.15 74.83,22.15 74.32,21.65 74.32,17.96 76.35,15.93 SV5.3 | v85.31,20.95 87.78,18.47 IC4.12
  Bottom 0.22: v85.31,20.95 80.16,20.95 IC4.4 | R28.2 67.21,7.99 66.13,6.91 59.97,6.91 57.75,9.14 57.75,13.33 59.59,13.33 IC3.10 | IC3.6 51.97,15.87 56.48,15.87 58.95,13.39 IC3.10 | SV5.3 76.35,15.87 75.85,15.36 65.69,15.36 65.05,14.72 60.99,14.72 59.65,13.39 IC3.10
OI4-1
  Top 0.254: SV2.1 32.9,4.3 O/I4.TIP
OI4-2  (via drill 0.3)
  Top 0.22: v56.67,20.31 56.67,15.74 v56.22,15.3 57.75,13.77 57.75,12.88 58.64,11.99 67.91,11.99 68.73,11.17 68.73,7.74 69.56,6.91 75.59,6.91 76.35,7.68 76.35,10.79 SV5.1 | R29.2 87.59,8.06 85.94,9.71 85.94,14.03 87.78,15.87 IC4.11
  Bottom 0.22: v56.22,15.3 53.88,15.3 51.97,13.39 IC3.7 | v56.67,20.31 57.3,20.95 59.59,20.95 IC3.13 | IC4.5 80.16,18.41 82.39,16.18 87.53,16.18 87.78,15.93 IC4.11 | SV5.1 76.42,10.79 77.43,9.77 78.89,9.77 79.53,9.14 87.47,9.14 88.55,8.06 R29.2
RES-1
  Top 0.254: SV1.3 11.23,15.9 9.4,17.73 9.4,30.6 RES.TIP
RES-2
  Top 0.22: R8.1 R12.1 81.88,73.91 81.69,73.72 81.69,72.95 80.86,72.13 71.59,72.13 70.51,73.21 70.51,73.84 69.81,74.54 68.8,74.54 68.03,73.78 68.03,35.93 66.13,34.03 66.13,28.44 66.39,28.19 66.39,23.11 65.62,22.34 58.38,22.34 57.49,21.46 57.49,17.9 58.07,17.33 60.48,17.33 61.75,16.06 62,15.93 63.4,15.93 SV4.3
REV-1
  Top 0.254: SV1.2 11.14,13.36 REV.TIP
REV-2  (via drill 0.3)
  Top 0.22: v67.65,13.33 71.08,16.76 71.08,34.54 70.96,34.66 70.96,64.76 77.94,71.75 86.51,71.75 87.53,72.76 R7.1
  Bottom 0.22: R11.1 79.15,73.91 80.16,72.89 86.51,72.89 87.53,73.91 R7.1 | v67.65,13.33 63.46,13.33 SV4.2
SW1-1  (via drill 0.3)  (1 unrouted)
  Top 0.254: 13.97,63.96 14.48,63.45 14.48,59.64 10.67,55.83 10.67,44.2 12.2,42.68 SV3.4 | 13.97,78.44 11.94,80.47 9.91,80.47 7.62,82.75 7.62,89.99 v8.13,90.5
  Bottom 0.254: SW1.3 v8.13,90.5 9.91,90.5 SW1.4
SW1-2  (1 unrouted)
  Top 0.22: C14.1 59.4,46.85 59.4,57.52 58.89,58.03 57.11,58.03 R36.2
  Bottom 0.22: C14.1 61.88,42.73 63.4,42.73 SV6.4
SW2-1  (via drill 0.3)
  Top 0.254: v24.39,35.26 24.39,70.76 SW2.3
  Bottom 0.254: SW2.3 SW2.4 | SV3.1 24.19,35.06 v24.39,35.26
SW2-2  (1 unrouted)
  Top 0.22: C15.1 57.11,38.35 57.11,52 52.73,56.38 R37.2
  Bottom 0.22: C15.1 60.35,35.11 63.4,35.11 SV6.1
SW3-1  (via drill 0.3)
  Top 0.254: v26.93,37.8 27.56,38.43 27.56,72.72 32.26,77.42 32.26,86.61 SW3.4
  Bottom 0.254: SW3.3 SW3.4 | SV3.2 26.73,37.6 v26.93,37.8
SW3-2  (1 unrouted)
  Top 0.22: C16.1 57.49,41.01 57.49,55.56 58.32,56.38 R38.2
  Bottom 0.22: C16.1 60.86,37.65 63.4,37.65 SV6.2
SW4-1  (via drill 0.3)
  Top 0.254: v2.04,40.34 2.04,65.74 3.31,67.01 3.31,71.16 SW4.3
  Bottom 0.254: SW4.3 SW4.4 | SV3.3 2.23,40.14 v2.04,40.34
SW4-2  (1 unrouted)
  Top 0.22: C17.1 59.78,44.19 59.78,55.05 61.11,56.38 R39.2
  Bottom 0.22: C17.1 61.37,40.19 63.4,40.19 SV6.3

### Text on the board
tPlace: HOLD | REV | RESET | FWD | HOLD | I/O1 | O/I1 | RESET | I/O2 | O/I2 | REV | I/O3 | O/I3 | FWD | I/O4 | O/I4
bPlace: -12V | POWER | -12V